# Altium project Limit_Switch_Bottom_Horizontal_v1.0.PrjPcb
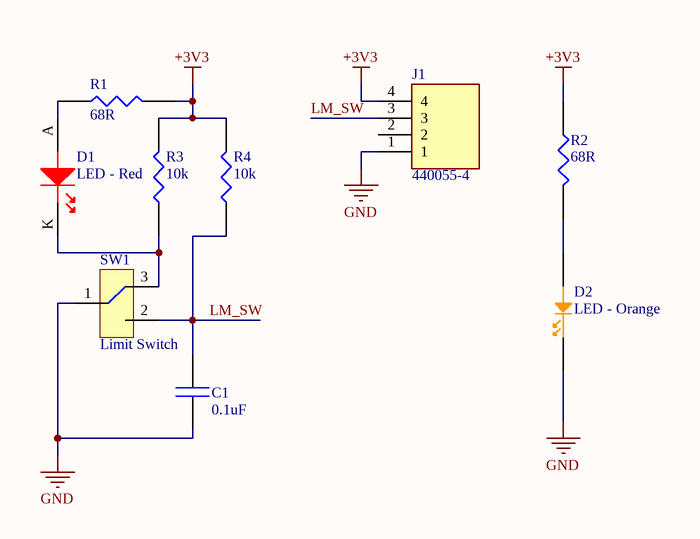
[diagram p0: Limit_Switch_Bottom_Horizontal_v1.0.SchDoc]
1 sheet, 9 parts. Net scope: global (net labels, ports and power ports of the same name join across sheets).
Board file: Limit_Switch_Bottom_Horizontal_v1.0.PcbDoc

## Sheet Limit_Switch_Bottom_Horizontal_v1.0.SchDoc
size A4

### Parts
C1  0.1uF  [0.1uF 0603]
D1  LED - Red  [LED 5MM]
D2  LED - Orange  [LED0603-Orange]
J1  440055-4  [TE_440055-4]
R1  68R  [68R 0603]
R2  68R  [68R 0603]
R3  10k  [10k R0603]
R4  10k  [10k R0603]
SW1  Limit Switch  [LIM SW 1]

### Nets
+3V3: J1.4 R1.2 R2.1 R3.2 R4.2
GND: C1.1 D2.1(Cathode) J1.1 SW1.1(COM)
LM_SW: C1.2 J1.3 R4.1 SW1.2(NO)
NetD1_A: D1.A(Anode) R1.1
NetD1_K: D1.K(Cathode) R3.1 SW1.3(NC)
NetD2_2: D2.2(Anode) R2.2

Not connected (* = marked no-connect by the designer): J1 2

### Library data of the parts
C1 = C0603C104M4RACTU: CAP CER 0.1UF 16V X7R 0603; Manufacturer: KEMET; Dielectric Material: Ceramic; Capacitance: 100nF; Tolerance: 20%; Supplier 1: Digi-Key; Supplier Part Number 1: 399-1099-1-ND; Manufacturer Part Number: C0603C104M4RACTU; RoHS: Yes; Category: Ceramic Capacitors; Stock 1: 114153; Pricing 1: 1=0.10000, 10=0.03100, 50=0.01720, 100=0.01400, 500=0.01002, 1000=0.00787 (USD); Mount: Surface Mount,PCB; Case/Package: 0603; Number of Pins: 2; Case Code (Metric): 1608; Case Code (Imperial): 0603; Min Operating Temperature: -55°C; Max Operating Temperature: 125°C; Package Quantity: 1; Voltage Rating: 16V; Packaging: Tape and Reel; Voltage Rating (DC): 16V; Dielectric: X7R; Termination: SMD/SMT; Length: 1.6mm; Height: 0.8mm; Width: 0.031inch; Thickness: 0.034inch; Lead Pitch: 0.7mm; Depth: 0.8mm; Radiation Hardening: No; REACH SVHC: No SVHC; ComponentLink1URL: https://datasheet.ciiva.com/18102/getdatasheetpartid-66190-18102310.pdf?src-supplier=Verical; ComponentLink1Description: https://datasheet.ciiva.com/18102/getdatasheetpartid-66190-18102310.pdf?src-supplier=Verical; ComponentLink2URL: https://datasheet.ciiva.com/7823/kem-c1002-x7r-smd-7823992.pdf?src-supplier=Element14; ComponentLink2Description: https://datasheet.ciiva.com/7823/kem-c1002-x7r-smd-7823992.pdf?src-supplier=Element14; ComponentLink3URL: https://datasheet.ciiva.com/7823/kem-c1002-x7r-smd-7823993.pdf?src-supplier=Element14; ComponentLink3Description: https://datasheet.ciiva.com/7823/kem-c1002-x7r-smd-7823993.pdf?src-supplier=Element14; ComponentLink4URL: https://datasheet.ciiva.com/14589/70095383-14589450.pdf?src-supplier=Allied+Electronics; ComponentLink4Description: https://datasheet.ciiva.com/14589/70095383-14589450.pdf?src-supplier=Allied+Electronics; ComponentLink5URL: https://datasheet.ciiva.com/18192/getdatasheetpartid-302288-18192716.pdf?src-supplier=Verical; ComponentLink5Description: https://datasheet.ciiva.com/18192/getdatasheetpartid-302288-18192716.pdf?src-supplier=Verical
D1 = C5SMF-RJF-CT0W0BB2: LED RED CLEAR 5MM OVAL T/H; Manufacturer: Cree; Forward Current: 20mA; Forward Voltage: 2.1V; Luminous Intensity: 2640mcd; Lens Style: Elliptical; Viewing Angle: 40°; Dominant Wavelength: 621nm; Supplier 1: Digi-Key; Supplier Part Number 1: C5SMF-RJF-CT0W0BB2CT-ND; Manufacturer Part Number: C5SMF-RJF-CT0W0BB2; RoHS: Yes; Category: LEDs; Stock 1: 32149; Pricing 1: 1=0.14000, 10=0.13200, 100=0.12160, 1000=0.10877 (USD); Mount: Through Hole; Case/Package: Radial; Lens Color: Red; Color: Red; Min Operating Temperature: -40°C; Max Operating Temperature: 95°C; Illumination Color: Red; Lens Transparency: Clear; Test Current: 20mA; Package Quantity: 2500; Packaging: Tape and Reel; Height: 10.95mm; ComponentLink1URL: https://datasheet.ciiva.com/29561/c5smfrjfrjegjfgjebjfbje1240-29561925.pdf?src-supplier=Digi-Key; ComponentLink1Description: https://datasheet.ciiva.com/29561/c5smfrjfrjegjfgjebjfbje1240-29561925.pdf?src-supplier=Digi-Key
D2 = LTST-C191KFKT: LED ORANGE CLEAR SMD; Manufacturer: Vishay Lite-On; Lens Color: Colorless; Wavelength: 611nm; Number of LEDs: 1; Viewing Angle: 130°; Lens Style: Diffused,Colorless,Rectangular; Luminous Intensity: 90mcd; Forward Current: 30mA; Forward Voltage: 2V; Power Rating: 75mW; Reverse Voltage: 5V; Dominant Wavelength: 605nm; Test Current: 20mA; Supplier 1: Digi-Key; Supplier Part Number 1: 160-1445-1-ND; Manufacturer Part Number: LTST-C191KFKT; RoHS: Yes; Category: LEDs; Stock 1: 92562; Pricing 1: 1=0.24000, 10=0.17900, 100=0.08460, 500=0.05640, 1000=0.04418, 2500=0.04324 (USD); Mount: Surface Mount; Case/Package: 0603; Number of Pins: 2; Case Code (Metric): 1608; Color: Orange; Case Code (Imperial): 0603; Min Operating Temperature: -55°C; Max Operating Temperature: 85°C; Package Quantity: 1; Packaging: Tape and Reel; Illumination Color: Orange; Lens Transparency: Clear; Number of Elements: 1; Power Dissipation: 75mW; Length: 1.6mm; Height: 0.55mm; Width: 0.8mm; Depth: 0.8mm; Radiation Hardening: No; Lead Free: Lead Free; ComponentLink1URL: https://datasheet.ciiva.com/2109/ltst-c191kfkt-2109968.pdf?src-supplier=Digi-Key; ComponentLink1Description: https://datasheet.ciiva.com/2109/ltst-c191kfkt-2109968.pdf?src-supplier=Digi-Key; ComponentLink2URL: https://datasheet.ciiva.com/12400/100-ltst-c191kfkt-39904-12400811.pdf?src-supplier=Mouser; ComponentLink2Description: https://datasheet.ciiva.com/12400/100-ltst-c191kfkt-39904-12400811.pdf?src-supplier=Mouser; ComponentLink3URL: https://datasheet.ciiva.com/11775/0900766b80dc02b0-11775613.pdf?src-supplier=RSComponents; ComponentLink3Description: https://datasheet.ciiva.com/11775/0900766b80dc02b0-11775613.pdf?src-supplier=RSComponents; ComponentLink4URL: https://datasheet.ciiva.com/15201/getdatasheetpartid-631075-15201391.pdf?src-supplier=Verical; ComponentLink4Description: https://datasheet.ciiva.com/15201/getdatasheetpartid-631075-15201391.pdf?src-supplier=Verical; ComponentLink5URL: https://datasheet.ciiva.com/2109/s-110-ltst-c191kfkt-2109969.pdf?src-supplier=Digi-Key; ComponentLink5Description: https://datasheet.ciiva.com/2109/s-110-ltst-c191kfkt-2109969.pdf?src-supplier=Digi-Key
J1 = 440055-4: 2.0MM,HDR,4POS,R/A; MF: TE Connectivity; Number_of_Positions: 4; Product_Type: Connector; Centerline_Pitch: 2 mm[.079 in]; MP: 440055-4; Price: None; Package: None; DigiKey-Purchase-URL: https://snapeda.com/shop?store=DigiKey&id=2374829; Value: *; Availability: Unavailable; EU_RoHS_Compliance: Compliant; Mouser-Purchase-URL: https://snapeda.com/shop?store=Mouser&id=2374829; SnapEDA_Link: https://www.snapeda.com/parts/440055-4/TE%20Connectivity%20AMP%20Connectors/view-part/2374829/?ref=snap
R1 R2 = CRGP0603F68R: CRGP 0603 68R 1%; Manufacturer: TE Connectivity; Max Power Dissipation: 250mW; Temperature Coefficient: 200ppm/°C; Supplier 1: Digi-Key; Supplier Part Number 1: A130402CT-ND; Manufacturer Part Number: CRGP0603F68R; RoHS: No; Category: Chip SMD Resistors; Stock 1: 49308; Pricing 1: 1=0.14000, 10=0.11400, 100=0.04470, 1000=0.01870, 2500=0.01714 (USD); Case/Package: 0603; Case Code (Imperial): 0603; Case Code (Metric): 1608; Min Operating Temperature: -55°C; Max Operating Temperature: 155°C; Resistor Type: Thick Film; Packaging: Tape and Reel; Resistance: 68R; Tolerance: 1%; Number of Terminations: 2; ComponentLink1URL: https://www.te.com/commerce/DocumentDelivery/DDEController?Action=srchrtrv&amp;DocNm=9-1773463-9&amp;DocType=DS&amp;DocLang=English&src-supplier=Digi-Key; ComponentLink1Description: https://www.te.com/commerce/DocumentDelivery/DDEController?Action=srchrtrv&amp;DocNm=9-1773463-9&amp;DocType=DS&amp;DocLang=English&src-supplier=Digi-Key
R3 R4 = CRG0603F10K/10: RES 10.0K OHM 1/10W 1% 0603; Manufacturer: TE Connectivity; Voltage Rating: 50V; Number of Resistors: 1; Resistance: 10kR; Power Rating: 100mW; Temperature Coefficient: 100ppm/°C; Supplier 1: Digi-Key; Supplier Part Number 1: A121523CT-ND; Manufacturer Part Number: CRG0603F10K/10; RoHS: Yes; Category: Chip SMD Resistors; Stock 1: 172089; Pricing 1: 1=0.10000, 10=0.03100, 100=0.01270, 1000=0.00570, 2500=0.00494, 5000=0.00409 (USD); Mount: Surface Mount; Case/Package: 0603; Weight: 7.1E-05oz; Case Code (Imperial): 0603; Min Operating Temperature: -55°C; Max Operating Temperature: 125°C; Resistor Type: Thick Film; Number of Terminations: 2; Termination: Solder; Packaging: Tape and Reel; Tolerance: 1%; Package Quantity: 10000; Max Power Dissipation: 100mW; Length: 1.6mm; Height: 0.022inch; Depth: 0.8mm; Width: 0.8mm; Radiation Hardening: No; Military Standard: Not; ELV: Compliant; ComponentLink1URL: https://datasheet.ciiva.com/2530/eng-cd-1622829-ba-2530062.pdf?src-supplier=Digi-Key; ComponentLink1Description: https://datasheet.ciiva.com/2530/eng-cd-1622829-ba-2530062.pdf?src-supplier=Digi-Key
SW1 = SS075Q102F035V2A: SWITCH SNAP ACT SPDT 100MA 125V; Manufacturer: E-Switch; Mechanical Life: 1000000Cycles; Switch Function: On-Mom; Electrical Life: 100000Cycles; Pretravel: 0.08inch; Operating Position: 0.425inch; Supplier 1: Digi-Key; Supplier Part Number 1: EG4929-ND; Manufacturer Part Number: SS075Q102F035V2A; RoHS: Yes; Category: Snap Action / Limit Switches; Stock 1: 5246; Pricing 1: 1=1.18000, 10=1.11800, 25=1.07280, 50=1.02820, 100=0.98340, 250=0.78224, 500=0.71520, 1000=0.69285, 5000=0.62580 (USD); Mount: Through Hole; Min Operating Temperature: -25°C; Max Operating Temperature: 75°C; Packaging: Bulk; Current Rating: 100mA; Voltage Rating (AC): 125V; Package Quantity: 120; Throw Configuration: SPDT; Termination: PC Pin; ComponentLink1URL: https://datasheet.ciiva.com/2892/q971024-2892235.pdf?src-supplier=Digi-Key; ComponentLink1Description: https://datasheet.ciiva.com/2892/q971024-2892235.pdf?src-supplier=Digi-Key